# EAGLE design untitled (EAGLE 9.3.0)
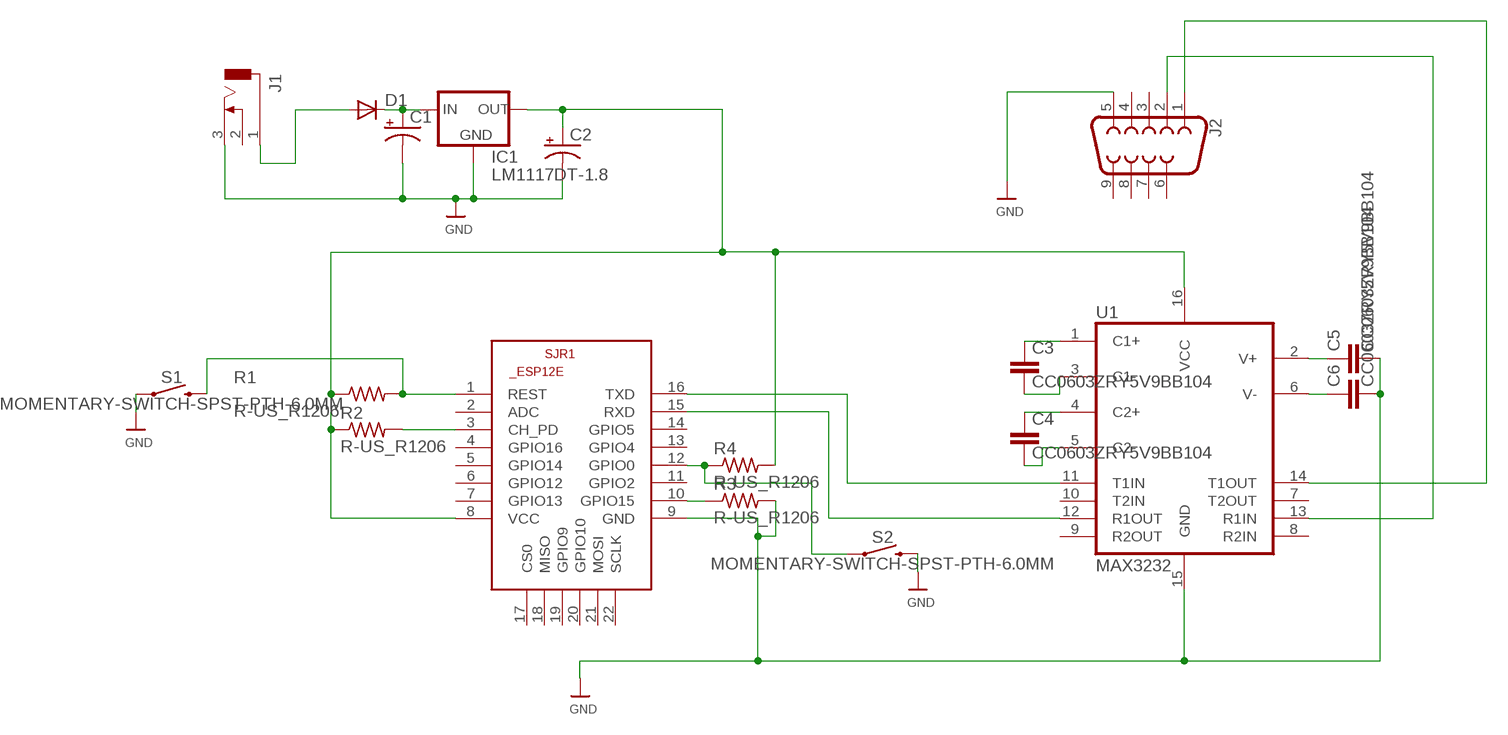
[diagram p0: schematic, sheet 1]

## Parts
C1  CPOL-US175TMP-0810  [175TMP-0810]
C2  CPOL-US175TMP-0810  [175TMP-0810]
C3  CC0603ZRY5V9BB104  [CC0603ZRY5V9BB104]
C4  CC0603ZRY5V9BB104  [CC0603ZRY5V9BB104]
C5  CC0603ZRY5V9BB104  [CC0603ZRY5V9BB104]
C6  CC0603ZRY5V9BB104  [CC0603ZRY5V9BB104]
D1  DIODESMA  [SMADIODE]
IC1  LM1117DT-1.8  [TO252]
J1  DCJ0303  [DCJ0303]
J2  DB9MALE  [DB9_MALE]
R1  R-US_R1206  [R1206]
R2  R-US_R1206  [R1206]
R3  R-US_R1206  [R1206]
R4  R-US_R1206  [R1206]
S1  MOMENTARY-SWITCH-SPST-PTH-6.0MM  [TACTILE_SWITCH_PTH_6.0MM]
S2  MOMENTARY-SWITCH-SPST-PTH-6.0MM  [TACTILE_SWITCH_PTH_6.0MM]
SJR1  ESP8266-12EESP12E  [ESP8266-ESP12E]
U1  MAX3232  MAX2323SOIC16  [SO16]

## Nets
GND: C1.- C2.- C5.2 C6.2 IC1.1(GND) J1.3 J2.5 R3.2 S1.1 S2.3 SJR1.9(GND) U1.15(GND)
N$1: R2.2 SJR1.3(CH_PD)
N$2: D1.A J1.1
N$3: C1.+ D1.C IC1.2(IN)
N$5: R1.2 S1.3 SJR1.1(REST)
N$6: R3.1 SJR1.10(GPIO15)
N$7: C3.1 U1.1(C1+)
N$8: R4.1 S2.1 SJR1.12(GPIO0)
N$9: C3.2 U1.3(C1-)
N$10: C4.1 U1.4(C2+)
N$11: C4.2 U1.5(C2-)
N$12: C5.1 U1.2(V+)
N$13: C6.1 U1.6(V-)
N$14: SJR1.16(TXD) U1.11(T1IN)
N$15: SJR1.15(RXD) U1.12(R1OUT)
N$16: J2.2 U1.13(R1IN)
N$17: J2.1 U1.14(T1OUT)
N$18: C2.+ IC1.3(OUT) R1.1 R2.1 R4.2 SJR1.8(VCC) U1.16(VCC)
Unconnected: J1.2 J2.3 J2.4 J2.6 J2.7 J2.8 J2.9 SJR1.2(ADC) SJR1.4(GPIO16) SJR1.5(GPIO14) SJR1.6(GPIO12) SJR1.7(GPIO13) SJR1.11(GPIO2) SJR1.13(GPIO4) SJR1.14(GPIO5) SJR1.17(CS0) SJR1.18(MISO) SJR1.19(GPIO9) SJR1.20(GPIO10) SJR1.21(MOSI) SJR1.22(SCLK) U1.7(T2OUT) U1.8(R2IN) U1.9(R2OUT) U1.10(T2IN)

## Library data of the parts
C1 C2 = adafruit:CPOL-US: POLARIZED CAPACITOR, American symbol
C3-C6 = Evllve PCB Array:CC0603ZRY5V9BB104: CAP CER 0.1UF 50V Y5V 0603; MANUFACTURER: Yageo; MANUFACTURER_PN: CC0603ZRY5V9BB104
D1 = adafruit:DIODE: Diode SMADIODE - SMA Surface Mount Package 20V 1A Schottky Diode Digikey: 641-1014-6-ND DO-1N4148 - Through Hole Small Current Diode SOD-123 20V 1 A (.5mV Vf) Schottky Diode - Digikey: MBRX120TPMSCT-ND SOD-323 10V 570mA (.38mV Vf, 3ns) Schottky Diode - Digikey: ZLLS410CT-ND SOD-523 30V 30mA Schottky Diode (RB751S-40TE61) - Digikey: RB751S-40TE61CT-ND SOT23-R/W - SOT23 Package (R = Solder Paste/Reflow Ovens, W = Hand-Soldering) BAT54Film 40V 300mA - Digikey: 497-7162-1-ND
IC1 = lm1117_10:LM1117?-*: 800mA Low-Dropout Linear Regulator Source: http://www.ti.com/lit/ds/symlink/lm1117-n.pdf; MF: Texas Instruments; MPN: LM1117DT-1.8; OC_FARNELL: 1798351; OC_NEWARK: 73R9726
J1 = con-jack:DCJ0303: DC POWER JACK Source: DCJ0303.pdf; OC_FARNELL: unknown; OC_NEWARK: unknown
J2 = SparkFun-Connectors:DB9: DB9 Connector Standard DB9 (D-Sub 9) serial connector. Can be used for CAN bus as well as RS485 and RS232. Footprint production proven. Here is the female version connector we sell at SparkFun: 9 Pin Female Serial Connector - PCB Mount <https://www.sparkfun.com/products/429> (PRT-00429) This connector has been used on the following SparkFun products: SparkFun RS232 Shifter - SMD <https://www.sparkfun.com/products/449> (PRT-00449) SparkFun RS232 Shifter SMD (No DB9) <https://www.sparkfun.com/products/8780> (PRT-08780); PROD_ID: CONN-09904
R1-R4 = audio amplifier example:R-US_: RESISTOR, American symbol
S1 S2 = SparkFun-Switches:MOMENTARY-SWITCH-SPST: Momentary Switch (Pushbutton) - SPST Normally-open (NO) SPST momentary switches (buttons, pushbuttons). Variants PTH-12MM - 12mm square, through-hole Momentary Pushbutton Switch - 12mm Square <https://www.sparkfun.com/products/9190> (COM-09190) PTH-6.0MM, PTH-6.0MM-KIT - 6.0mm square, through-hole Mini Pushbutton Switch <https://www.sparkfun.com/products/97> (COM-00097) KIT package intended for soldering kit's - only one side of pads' copper is exposed. PTH-RIGHT-ANGLE-KIT - Right-angle, through-hole Right Angle Tactile Button <https://www.sparkfun.com/products/10791> - Used on SparkFun BigTime Watch Kit <https://www.sparkfun.com/products/11734> SMD-12MM - 12mm square, surface-mount Tactile Button - SMD (12mm) <https://www.sparkfun.com/products/12993> (COM-12993) Used on SparkFun PicoBoard <https://www.sparkfun.com/products/11888> SMD-4.5MM - 4.5mm Square Trackball Switch Used on SparkFun Blackberry Trackballer Breakout <https://www.sparkfun.com/products/13169> SMD-4.6MMX2.8MM - 4.60mm x 2.80mm, surface mount Used on SparkFun SAMD21 Mini Breakout <https://www.sparkfun.com/products/13664> SMD-5.2MM, SMD-5.2-REDUNDANT - 5.2mm square, surface-mount Mini Pushbutton Switch - SMD <https://www.sparkfun.com/products/8720> (COM-08720) Used on Arduino Pro Mini <https://www.sparkfun.com/products/11114> REDUNDANT package connects both switch circuits together SMD-6.0X3.5MM - 6.0 x 3.5mm, surface mount Momentary Reset Switch SMD <https://www.sparkfun.com/products/8229> (COM-08229) SMD-6.2MM-TALL - 6.2mm square, surface mount Tactile Button - SMD (6mm) <https://www.sparkfun.com/products/12992> Used on SparkFun Digital Sandbox <https://www.sparkfun.com/products/12651> SMD-RIGHT-ANGLE - Right-angle, surface mount Used on SparkFun Block for Intel® Edison - Arduino <https://www.sparkfun.com/products/13036>; PROD_ID: SWCH-08441; SF_SKU: COM-00097
SJR1 = esp12e:ESP8266-12E: ESP8266-12E Library for Eagle CAD The author not responsible for any damages or errors!. Created by Suhail jr.lt;/author>
U1 = SparkFun-IC-Comms:MAX2323: RS232 Transceiver This part covers 232 drivers that are compatible with the MAX3232. Sipex SP3232EB Datasheet <http://cdn.sparkfun.com/datasheets/Components/General%20IC/SP3232EBCA-L.pdf> SparkFun Products SOIC component <https://www.sparkfun.com/products/589> (COM-00589 / IC-08171) Retired DIP component (COM-00316 / IC-08446) SparkFun Transceiver Breakout - MAX3232 <https://www.sparkfun.com/products/11189> (BOB-11189) SparkFun XBee Explorer Serial <https://www.sparkfun.com/products/13225> (WRL-13225); PROD_ID: IC-08171

## Board
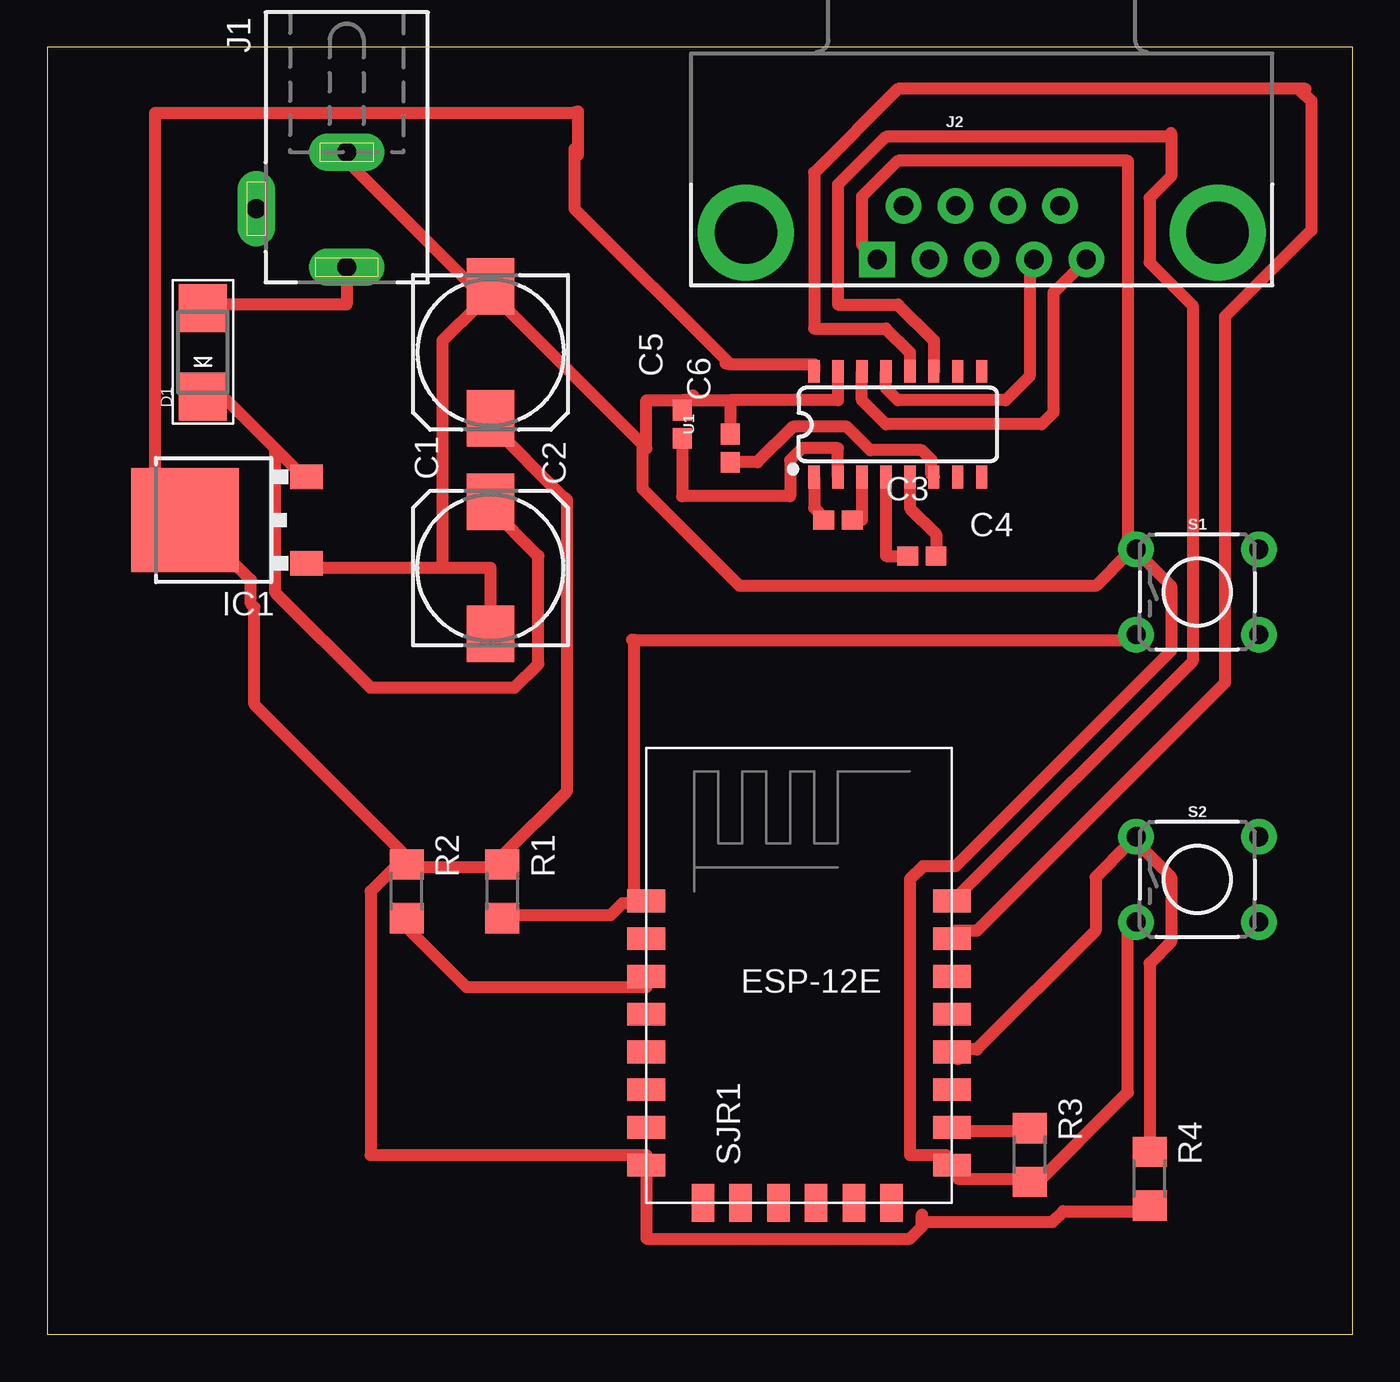
[diagram p1: board, top side]

Size 69.19 x 68.25 mm. Coordinates in mm from the lower left corner, seen from the top.
Outline: 0,0 69.19,0 69.19,68.25 0,68.25 0,0
Copper layers (1*16): Top 0.035mm / dielectric 1.5mm / Bottom 0.035mm
Design rules "default *": minimum track width 25mil, minimum drill 0.35mm, track to track 20mil, track to pad 20mil, pad to pad 6mil, via to via 6mil, smd to smd 6mil, copper to edge 40mil, drill to drill 6mil, minimum pad ring 10mil, minimum via ring 8mil, stop-mask expansion 4mil, vias tented up to drill 0mil, thermal gap 10mil

### Footprints (pad centres in the part's own frame; a part is rotated, then mirrored left to right if it is on the bottom)
175TMP-0810 = smd 3 x 2.5: + 3.5,0; - -3.5,0
CC0603ZRY5V9BB104 = smd 1.1 x 1: 1 -0.75,0; 2 0.75,0
SMADIODE = smd 2.54 x 2.54: A 2.349,0; C -2.349,0
TO252 = smd 1.3 x 1.7: 1 -2.285,-4.22; 2 2.285,-4.22 | smd 5.5 x 5.7: 3 0,2.22
DCJ0303 = drill 1 pad 2 long: 1 0,3.1; 2 4.8,0; 3 0,-3
DB9_MALE = drill 1.016 pad 1.88: 1 5.54,-1.42; 2 2.77,-1.42; 3 0,-1.42; 4 -2.77,-1.42; 6 4.15,1.42; 7 1.38,1.42; 8 -1.38,1.42; 9 -4.15,1.42 | drill 1.016 pad 1.88 square: 5 -5.54,-1.42 | drill 3.302 pad 5.08: G1 -12.5,0; G2 12.5,0
R1206 = smd 1.6 x 1.803: 1 -1.422,0; 2 1.422,0
TACTILE_SWITCH_PTH_6.0MM = drill 1.016 pad 1.88: 1 -3.251,2.261; 2 3.251,2.261; 3 -3.251,-2.261; 4 3.251,-2.261
ESP8266-ESP12E = smd 2 x 1.2: 1 -7.62,5.84; 2 -7.62,3.84; 3 -7.62,1.84; 4 -7.62,-0.16; 5 -7.62,-2.16; 6 -7.62,-4.16; 7 -7.62,-6.16; 8 -7.62,-8.16; 9 8.58,-8.16; 10 8.58,-6.16; 11 8.58,-4.16; 12 8.58,-2.16; 13 8.58,-0.16; 14 8.58,1.84; 15 8.58,3.84; 16 8.58,5.84 | smd 1.2 x 2: 17 -4.62,-10.16; 18 -2.62,-10.16; 19 -0.62,-10.16; 20 1.38,-10.16; 21 3.38,-10.16; 22 5.38,-10.16
SO16 = smd 0.6 x 1.2: 1 -4.445,-2.8; 2 -3.175,-2.8; 3 -1.905,-2.8; 4 -0.635,-2.8; 5 0.635,-2.8; 6 1.905,-2.8; 7 3.175,-2.8; 8 4.445,-2.8; 9 4.445,2.8; 10 3.175,2.8; 11 1.905,2.8; 12 0.635,2.8; 13 -0.635,2.8; 14 -1.905,2.8; 15 -3.175,2.8; 16 -4.445,2.8

### Placement (x,y rotation side)
C1  23.5,40.64 90 top
C2  23.5,52.07 270 top
C3  41.91,43.18 0 top
C4  46.35,41.28 0 top
C5  33.66,48.26 90 top
C6  36.19,46.99 90 top
D1  8.25,52.07 90 top
IC1  9.52,43.18 90 top
J1  15.88,59.69 180 top
J2  49.53,58.42 0 top
R1  24.13,23.49 270 top
R2  19.05,23.49 270 top
R3  52.07,9.52 270 top
R4  58.42,8.26 270 top
S1  60.96,39.37 0 top
S2  60.96,24.13 0 top
SJR1  39.37,17.15 0 top
U1  45.08,48.26 0 top

### Tracks (layer width: path | path; a pad name or v marks a point on that pad's centre or on a via)
GND
  Top 0.635: 36.19,49.53 41.91,49.53 U1.15 | 34.29,49.53 33.66,49.53 | 36.19,49.53 C6.2 | 20.96,40.64 23.5,40.64 C1.- | 20.96,40.64 13.97,40.64 IC1.1 | 22.86,54.61 20.96,52.7 20.96,40.64 | 22.86,54.61 23.5,55.25 | 22.86,54.61 22.86,55.25 15.88,62.23 J1.3 | 22.86,54.61 C2.- 23.5,55.25 | 33.66,49.53 31.75,49.53 31.75,46.99 31.59,47.15 | 34.29,49.53 36.19,49.53 | 33.66,49.53 C5.2 | J2.5 43.81,57.15 43.18,57.78 43.18,60.33 45.08,62.23 57.28,62.23 57.28,41.97 S1.1 | 34.23,49.78 34.29,49.53 | 31.59,47.15 23.5,55.25 | S2.3 57.28,21.4 57.28,12.83 52.13,7.68 R3.2 52.07,8.26 48.26,8.26 48.26,8.89 SJR1.9 47.62,9.52 45.72,9.52 45.72,24.13 46.42,24.83 48.13,24.83 59.56,36.26 59.56,39.69 57.85,41.4 S1.1 | 31.59,47.15 31.56,47.12 31.56,44.83 36.7,39.69 55.56,39.69 57.28,41.4 S1.1
N$1
  Top 0.635: R2.2 19.05,21.59 22.22,18.41 31.75,18.41 SJR1.3
N$2
  Top 0.635: J1.1 15.88,54.61 8.25,54.61 D1.A
N$3
  Top 0.635: 12.07,46.99 9.52,49.53 8.25,49.53 D1.C | 12.07,46.99 13.33,45.72 IC1.2 | 12.07,46.99 12.07,39.37 17.14,34.29 24.76,34.29 26.04,35.56 26.04,41.28 23.5,43.81 C1.+
N$5
  Top 0.635: 31.11,22.86 31.75,22.86 SJR1.1 31.11,22.86 | 31.11,22.86 30.48,22.86 29.85,22.23 24.13,22.23 R1.2 | 31.11,22.86 31.11,36.83 | 31.11,36.83 57.28,36.83 S1.3 | 30.99,36.83 31.11,36.83
N$6
  Top 0.635: R3.1 52.07,10.8 48.26,10.8 SJR1.10
N$7
  Top 0.635: U1.1 40.64,43.81 41.16,43.3 C3.1
N$8
  Top 0.635: 48.26,14.6 SJR1.12 48.13,15.11 49.28,15.11 55.56,21.4 55.56,24.26 57.28,25.97 S2.1 57.85,25.97 59.56,24.26 59.56,20.83 58.42,19.69 R4.1
N$9
  Top 0.635: U1.3 43.18,43.18 C3.2
N$10
  Top 0.635: U1.4 44.45,41.28 C4.1
N$11
  Top 0.635: U1.5 45.72,43.81 47.1,42.43 C4.2
N$12
  Top 0.635: U1.2 41.91,46.99 40,46.99 39.37,46.36 39.37,44.45 33.66,44.45 C5.1
N$13
  Top 0.635: U1.6 46.86,45.59 46.86,46.38 46.36,46.89 43.63,46.89 42.38,48.13 39.53,48.13 37.64,46.24 C6.1
N$14
  Top 0.635: 59.56,63.5 44.45,63.5 41.91,60.96 41.91,54.61 45.08,54.61 46.99,52.7 U1.11 | 59.56,63.5 59.56,61.4 58.42,60.26 58.42,56.83 60.71,54.55 60.71,35.69 48.13,23.11 SJR1.16 | 59.56,63.69 59.56,63.5
N$15
  Top 0.635: 66.67,66.04 66.42,66.04 | 66.42,66.04 45.08,66.04 40.64,61.59 40.64,53.34 44.45,53.34 45.72,52.07 U1.12 | 48.26,20.95 SJR1.15 48.13,21.4 49.28,21.4 62.42,34.54 62.42,53.97 66.99,58.55 66.99,65.41 66.42,65.98 66.42,66.04
N$16
  Top 0.635: U1.13 44.45,50.17 45.08,49.53 50.8,49.53 52.07,50.8 52.07,56.52 J2.2 52.7,56.52
N$17
  Top 0.635: U1.14 43.18,49.53 44.45,48.26 52.7,48.26 53.34,48.89 53.34,55.25 54.61,56.52 J2.1
N$18
  Top 0.635: 36.19,51.44 40.64,51.44 U1.16 | 46.35,5.72 46.35,6.35 | 46.35,5.72 45.72,5.08 31.75,5.08 SJR1.8 31.75,9.52 17.14,9.52 17.14,23.49 19.05,25.4 R2.1 | R2.1 19.05,24.77 24.13,24.77 R1.1 | C2.+ 23.5,48.26 27.31,44.45 27.56,44.26 27.56,28.83 24.13,25.4 R1.1 | 28.13,62.86 28.13,64.83 27.94,64.77 5.71,64.77 5.71,44.45 6.98,43.18 IC1.3 7.62,43.18 10.79,40 10.79,38.73 10.99,38.54 10.99,33.4 18.99,25.4 R2.1 | 28.13,62.86 28.13,62.55 | 35.94,51.5 36.19,51.44 | 24.51,24.96 R1.1 | 36.19,51.44 27.94,59.69 27.94,62.86 28.13,62.86 | R4.2 58.42,6.54 53.85,6.54 53.28,5.97 46.42,5.97 46.35,5.72